# EAGLE design Tally Board (EAGLE 6.4)
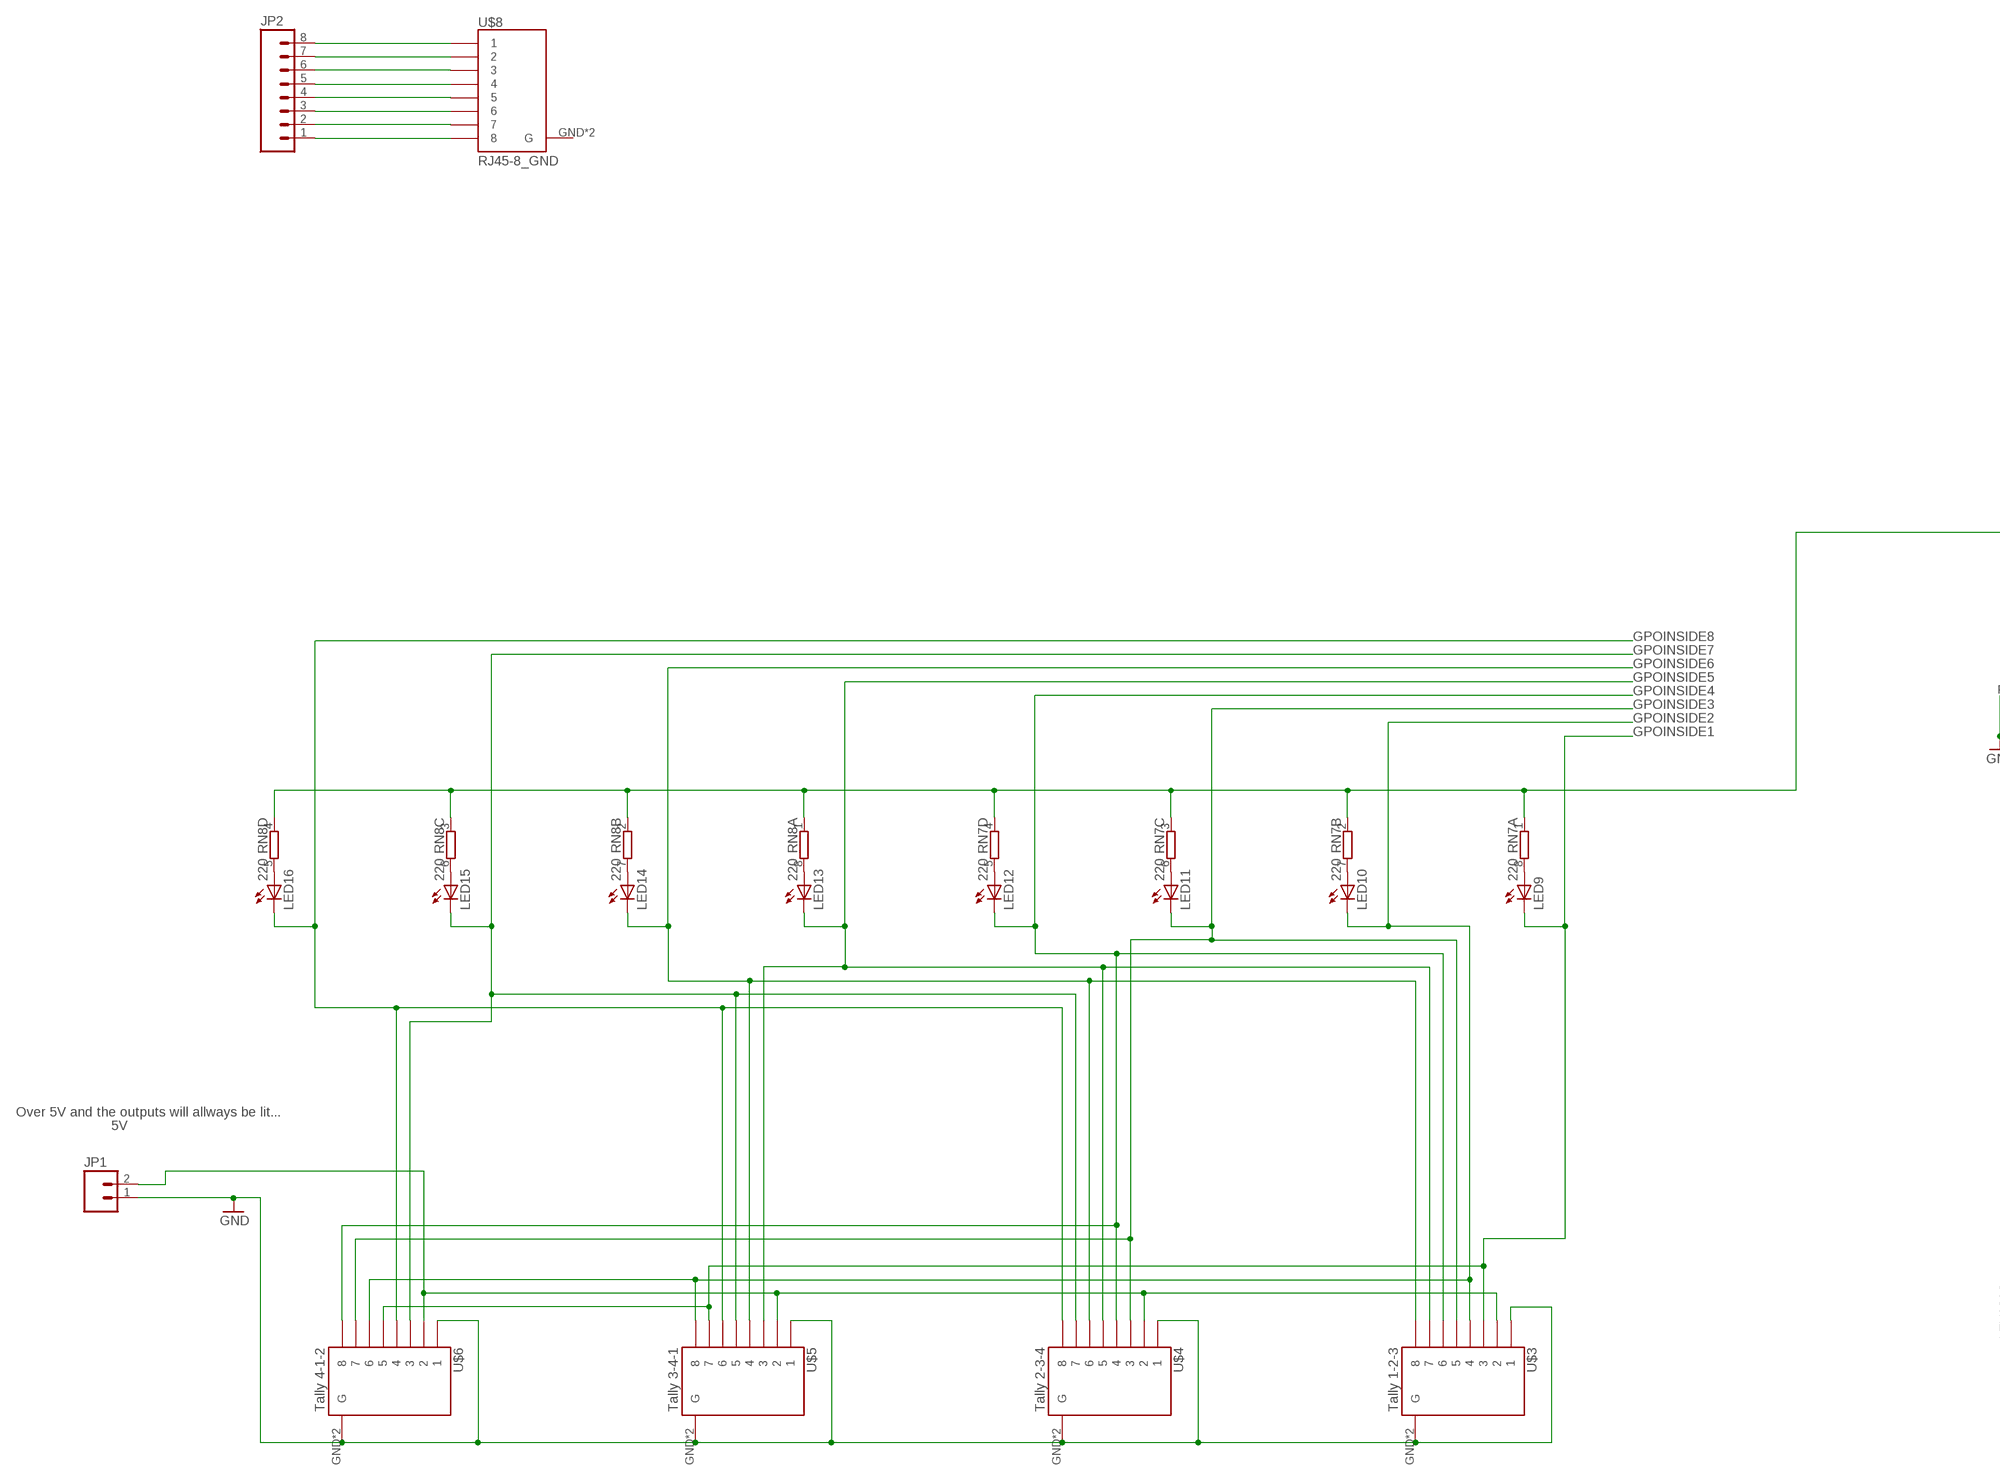
[diagram p0: schematic, sheet 1, part 1 of 2]
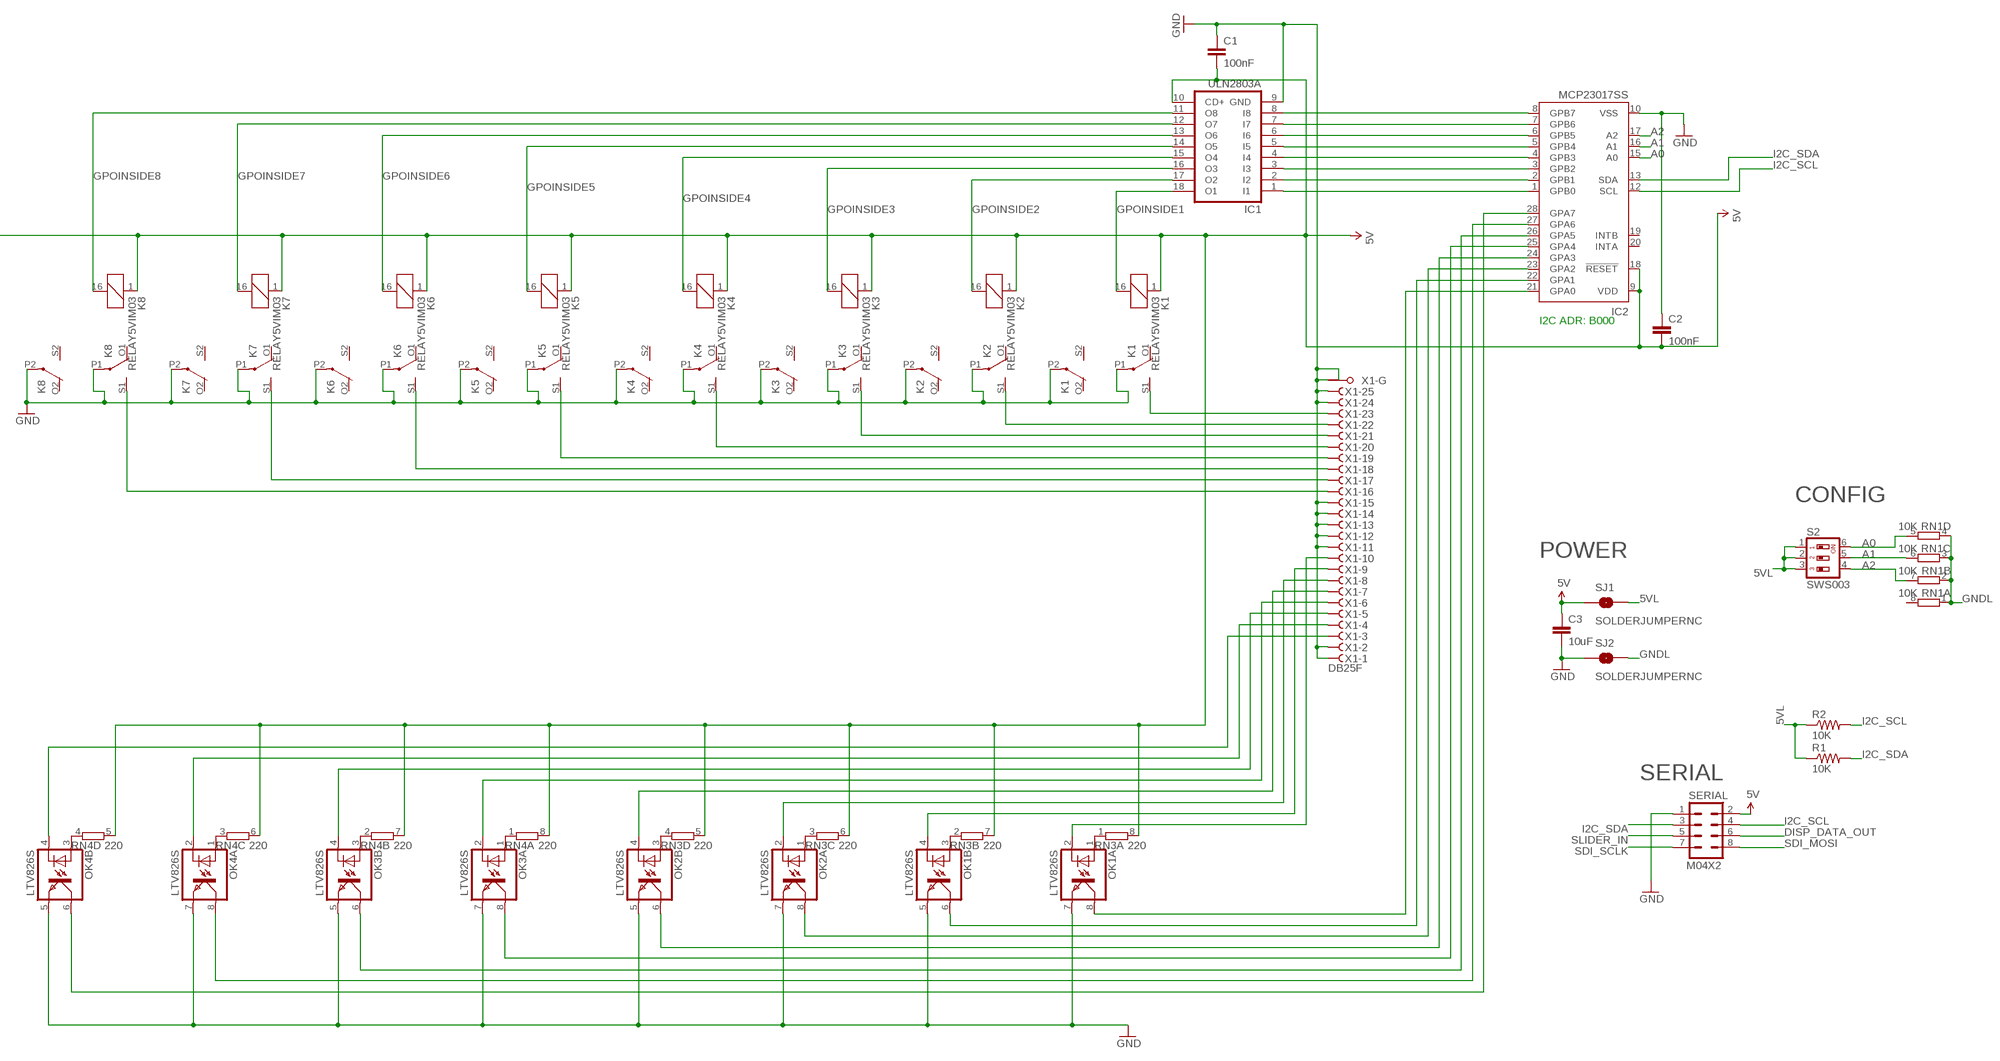
[diagram p1: schematic, sheet 1, part 2 of 2]

## Parts
C1  100nF  CAP0805  [0805]
C2  100nF  CAP0603-CAP  [0603-CAP]
C3  10uF  CAP0805  [0805]
IC1  ULN2803A  ULN2803ASO18W  [SO18W]
IC2  MCP23017SS  [SSOP28]
JP1  M02PTH4  [1X02_XTRA_BIG]
JP2  M081X08  [1X08]
K1  RELAY5VIM03  [DS2Y]
K2  RELAY5VIM03  [DS2Y]
K3  RELAY5VIM03  [DS2Y]
K4  RELAY5VIM03  [DS2Y]
K5  RELAY5VIM03  [DS2Y]
K6  RELAY5VIM03  [DS2Y]
K7  RELAY5VIM03  [DS2Y]
K8  RELAY5VIM03  [DS2Y]
LED9  LED3MM  [LED3MM]
LED10  LED3MM  [LED3MM]
LED11  LED3MM  [LED3MM]
LED12  LED3MM  [LED3MM]
LED13  LED3MM  [LED3MM]
LED14  LED3MM  [LED3MM]
LED15  LED3MM  [LED3MM]
LED16  LED3MM  [LED3MM]
OK1  LTV826S  [DIL8-SMD]
OK2  LTV826S  [DIL8-SMD]
OK3  LTV826S  [DIL8-SMD]
OK4  LTV826S  [DIL8-SMD]
R1  10K  RESISTOR0603-RES  [0603-RES]
R2  10K  RESISTOR0603-RES  [0603-RES]
RN1  10K  4R-NCAY16  [CAY16_HAND]
RN3  220  4R-NCAY16  [CAY16]
RN4  220  4R-NCAY16  [CAY16]
RN7  220  4R-NCAY16  [CAY16_HAND]
RN8  220  4R-NCAY16  [CAY16_HAND]
S2  SWS003  [SMS-003]
SERIAL  M04X2  [2X4]
SJ1  SOLDERJUMPERNC  [SJ_2S]
SJ2  SOLDERJUMPERNC  [SJ_2S]
U$3  Tally 1-2-3  RJ45-8_GND  [RJ45-8_GND]
U$4  Tally 2-3-4  RJ45-8_GND  [RJ45-8_GND]
U$5  Tally 3-4-1  RJ45-8_GND  [RJ45-8_GND]
U$6  Tally 4-1-2  RJ45-8_GND  [RJ45-8_GND]
U$8  RJ45-8_GND  [RJ45-8_GND]
X1  DB25F  F25HPS  [F25HP]

## Nets
5V [Power]: C1.2 C2.2 C3.1 IC1.10(CD+) IC2.9(VDD) IC2.18(!RESET) K1.1 K2.1 K3.1 K4.1 K5.1 K6.1 K7.1 K8.1 RN3.5 RN3.6 RN3.7 RN3.8 RN4.5 RN4.6 RN4.7 RN4.8 RN7.1 RN7.2 RN7.3 RN7.4 RN8.1 RN8.2 RN8.3 RN8.4 SERIAL.2 SJ1.1
5VL: R1.1 R2.1 S2.1 S2.2 S2.3 SJ1.2
A0: IC2.15(A0) RN1.5 S2.6
A1: IC2.16(A1) RN1.6 S2.5
A2: IC2.17(A2) RN1.7 S2.4
DISP_DATA_OUT: SERIAL.6
GND [Power]: C1.1 C2.1 C3.2 IC1.9(GND) IC2.10(VSS) JP1.1 K1.P1(2:P) K1.P2(3:P) K2.P1(2:P) K2.P2(3:P) K3.P1(2:P) K3.P2(3:P) K4.P1(2:P) K4.P2(3:P) K5.P1(2:P) K5.P2(3:P) K6.P1(2:P) K6.P2(3:P) K7.P1(2:P) K7.P2(3:P) K8.P1(2:P) K8.P2(3:P) OK1.5(B:EMIT) OK1.7(A:EMIT) OK2.5(B:EMIT) OK2.7(A:EMIT) OK3.5(B:EMIT) OK3.7(A:EMIT) OK4.5(B:EMIT) OK4.7(A:EMIT) SERIAL.1 SJ2.1 U$3.1 U$3.GND1(G) U$3.GND(G) U$4.1 U$4.GND1(G) U$4.GND(G) U$5.1 U$5.GND1(G) U$5.GND(G) U$6.1 U$6.GND1(G) U$6.GND(G) X1.1(-1:F) X1.2(-2:F) X1.11(-11:F) X1.12(-12:F) X1.13(-13:F) X1.14(-14:F) X1.15(-15:F) X1.24(-24:F) X1.25(-25:F) X1.G1(-G:G1) X1.G2(-G:G2)
GNDL: RN1.1 RN1.2 RN1.3 RN1.4 SJ2.2
GPOINSIDE1: IC1.18(O1) K1.16 LED9.K(C) U$3.3 U$5.7 U$6.5
GPOINSIDE2: IC1.17(O2) K2.16 LED10.K(C) U$3.4 U$5.8 U$6.6
GPOINSIDE3: IC1.16(O3) K3.16 LED11.K(C) U$3.5 U$4.3 U$6.7
GPOINSIDE4: IC1.15(O4) K4.16 LED12.K(C) U$3.6 U$4.4 U$6.8
GPOINSIDE5: IC1.14(O5) K5.16 LED13.K(C) U$3.7 U$4.5 U$5.3
GPOINSIDE6: IC1.13(O6) K6.16 LED14.K(C) U$3.8 U$4.6 U$5.4
GPOINSIDE7: IC1.12(O7) K7.16 LED15.K(C) U$4.7 U$5.5 U$6.3
GPOINSIDE8: IC1.11(O8) K8.16 LED16.K(C) U$4.8 U$5.6 U$6.4
I2C_SCL: IC2.12(SCL) R2.2 SERIAL.4
I2C_SDA: IC2.13(SDA) R1.2 SERIAL.3
N$1 [RELAY LINES]: K1.S1(2:S) X1.23(-23:F)
N$2: JP2.8 U$8.1
N$3: JP2.7 U$8.2
N$4: JP2.6 U$8.3
N$5: IC1.1(I1) IC2.1(GPB0)
N$6 [RELAY LINES]: K2.S1(2:S) X1.22(-22:F)
N$7: JP2.5 U$8.4
N$8: JP2.4 U$8.5
N$9: JP2.3 U$8.6
N$10 [RELAY LINES]: K3.S1(2:S) X1.21(-21:F)
N$11: JP2.2 U$8.7
N$12: JP2.1 U$8.8
N$14 [RELAY LINES]: K4.S1(2:S) X1.20(-20:F)
N$18 [RELAY LINES]: K5.S1(2:S) X1.19(-19:F)
N$22 [RELAY LINES]: K6.S1(2:S) X1.18(-18:F)
N$26 [RELAY LINES]: K7.S1(2:S) X1.17(-17:F)
N$27: LED9.A RN7.8
N$30 [RELAY LINES]: K8.S1(2:S) X1.16(-16:F)
N$31: LED10.A RN7.7
N$34: IC1.2(I2) IC2.2(GPB1)
N$35: IC1.3(I3) IC2.3(GPB2)
N$36: IC1.4(I4) IC2.4(GPB3)
N$37: IC1.5(I5) IC2.5(GPB4)
N$38: IC1.6(I6) IC2.6(GPB5)
N$39: IC1.7(I7) IC2.7(GPB6)
N$40: IC1.8(I8) IC2.8(GPB7)
N$49 [INput lines]: OK1.2(A:C) X1.10(-10:F)
N$50: OK1.1(A:A) RN3.1
N$51: IC2.21(GPA0) OK1.8(A:COL)
N$52: OK1.3(B:A) RN3.2
N$53: OK2.1(A:A) RN3.3
N$54: OK2.3(B:A) RN3.4
N$55 [INput lines]: OK3.2(A:C) X1.6(-6:F)
N$56: OK3.1(A:A) RN4.1
N$57: OK3.3(B:A) RN4.2
N$58: OK4.1(A:A) RN4.3
N$59: OK4.3(B:A) RN4.4
N$60 [INput lines]: OK1.4(B:C) X1.9(-9:F)
N$61 [INput lines]: OK2.2(A:C) X1.8(-8:F)
N$62 [INput lines]: OK2.4(B:C) X1.7(-7:F)
N$63: IC2.28(GPA7) OK4.6(B:COL)
N$64 [INput lines]: OK3.4(B:C) X1.5(-5:F)
N$65 [INput lines]: OK4.2(A:C) X1.4(-4:F)
N$66 [INput lines]: OK4.4(B:C) X1.3(-3:F)
N$68: IC2.22(GPA1) OK1.6(B:COL)
N$69: IC2.23(GPA2) OK2.8(A:COL)
N$70: IC2.24(GPA3) OK2.6(B:COL)
N$71: IC2.25(GPA4) OK3.8(A:COL)
N$72: IC2.26(GPA5) OK3.6(B:COL)
N$73: IC2.27(GPA6) OK4.8(A:COL)
N$76: LED11.A RN7.6
N$77: LED12.A RN7.5
N$78: LED13.A RN8.8
N$79: LED14.A RN8.7
N$80: LED15.A RN8.6
N$81: LED16.A RN8.5
N$82: JP1.2 U$3.2 U$4.2 U$5.2 U$6.2
SDI_MOSI: SERIAL.8
SDI_SCLK: SERIAL.7
SLIDER_IN: SERIAL.5
Unconnected: IC2.19(INTB) IC2.20(INTA) K1.O1(2:O) K1.O2(3:O) K1.S2(3:S) K2.O1(2:O) K2.O2(3:O) K2.S2(3:S) K3.O1(2:O) K3.O2(3:O) K3.S2(3:S) K4.O1(2:O) K4.O2(3:O) K4.S2(3:S) K5.O1(2:O) K5.O2(3:O) K5.S2(3:S) K6.O1(2:O) K6.O2(3:O) K6.S2(3:S) K7.O1(2:O) K7.O2(3:O) K7.S2(3:S) K8.O1(2:O) K8.O2(3:O) K8.S2(3:S) RN1.8

## Notes on the sheet
- I2C ADR: B000
- CONFIG
- POWER
- Over 5V and the outputs will allways be lit...
- 5V
- SERIAL

## Power pins joined to a net without a drawn wire
G: U$8.GND1(G) U$8.GND(G)

## Library data of the parts
C1-C3 = SparkFun:CAP: Capacitor Standard 0603 ceramic capacitor, and 0.1" leaded capacitor.
IC1 = uln-udn:ULN2803A: DRIVER ARRAY
IC2 = microchip:MCP23017: http://ww1.microchip.com/downloads/en/DeviceDoc/21952a.pdf Source: http://ww1.microchip.com/downloads/en/DeviceDoc/21952a.pdf; MF: MICROCHIP; MPN: MCP23017-E/SS; OC_FARNELL: 1467674; OC_NEWARK: 31K2960
JP1 = SparkFun:M02: Header 2 Standard 2-pin 0.1" header. Use with straight break away headers (SKU : PRT-00116), right angle break away headers (PRT-00553), swiss pins (PRT-00743), machine pins (PRT-00117), and female headers (PRT-00115). Molex polarized connector foot print use with SKU : PRT-08233 with associated crimp pins and housings.
JP2 = SKAARHOJ:M08: Header 8 Standard 8-pin 0.1" header. Use with straight break away headers (SKU : PRT-00116), right angle break away headers (PRT-00553), swiss pins (PRT-00743), machine pins (PRT-00117), and female headers (PRT-00115).
K1-K8 = SKAARHOJ:RELAY5V: RELAY 2 x switch, AxiCom 150 mW 5V
LED9-LED16 = led:LED: LED OSRAM: - CHIPLED LG R971, LG N971, LY N971, LG Q971, LY Q971, LO R971, LY R971 LH N974, LH R974 LS Q976, LO Q976, LY Q976 LO Q996 - Hyper CHIPLED LW Q18S LB Q993, LB Q99A, LB R99A - SideLED LS A670, LO A670, LY A670, LG A670, LP A670 LB A673, LV A673, LT A673, LW A673 LH A674 LY A675 LS A676, LA A676, LO A676, LY A676, LW A676 LS A679, LY A679, LG A679 - Hyper Micro SIDELED® LS Y876, LA Y876, LO Y876, LY Y876 LT Y87S - SmartLED LW L88C, LW L88S LB L89C, LB L89S, LG L890 LS L89K, LO L89K, LY L89K LS L896, LA L896, LO L896, LY L896 - TOPLED LS T670, LO T670, LY T670, LG T670, LP T670 LSG T670, LSP T670, LSY T670, LOP T670, LYG T670 LG T671, LOG T671, LSG T671 LB T673, LV T673, LT T673, LW T673 LH T674 LS T676, LA T676, LO T676, LY T676, LB T676, LH T676, LSB T676, LW T676 LB T67C, LV T67C, LT T67C, LS T67K, LO T67K, LY T67K, LW E67C LS E67B, LA E67B, LO E67B, LY E67B, LB E67C, LV E67C, LT E67C LW T67C LS T679, LY T679, LG T679 LS T770, LO T770, LY T770, LG T770, LP T770 LB T773, LV T773, LT T773, LW T773 LH T774 LS E675, LA E675, LY E675, LS T675 LS T776, LA T776, LO T776, LY T776, LB T776 LHGB T686 LT T68C, LB T68C - Hyper Mini TOPLED® LB M676 - Mini TOPLED Santana® LG M470 LS M47K, LO M47K, LY M47K Source: http://www.osram.convergy.de LUXEON: - LUMILED® LXK2-PW12-R00, LXK2-PW12-S00, LXK2-PW14-U00, LXK2-PW14-V00 LXK2-PM12-R00, LXK2-PM12-S00, LXK2-PM14-U00 LXK2-PE12-Q00, LXK2-PE12-R00, LXK2-PE12-S00, LXK2-PE14-T00, LXK2-PE14-U00 LXK2-PB12-K00, LXK2-PB12-L00, LXK2-PB12-M00, LXK2-PB14-N00, LXK2-PB14-P00, LXK2-PB14-Q00 LXK2-PR12-L00, LXK2-PR12-M00, LXK2-PR14-Q00, LXK2-PR14-R00 LXK2-PD12-Q00, LXK2-PD12-R00, LXK2-PD12-S00 LXK2-PH12-R00, LXK2-PH12-S00 LXK2-PL12-P00, LXK2-PL12-Q00, LXK2-PL12-R00 Source: www.luxeon.com KINGBRIGHT: KA-3528ASYC Source: www.kingbright.com
OK1-OK4 = optocoupler:LTV826: OPTO COUPLER Source: LITEON, LTV816.pdf; OC_FARNELL: unknown; OC_NEWARK: unknown
R1 R2 = SparkFun:RESISTOR: Resistor Basic schematic elements and footprints for 0603, 1206, and PTH resistors.
RN1 RN7 RN8 = SKAARHOJ:4R-N: Array Chip Resistor Source: RS Component / Phycomp; OC_FARNELL: unknown; OC_NEWARK: unknown
RN3 RN4 = resistor-dil:4R-N: Array Chip Resistor Source: RS Component / Phycomp; OC_FARNELL: unknown; OC_NEWARK: unknown
S2 = smd-special:SWS003: SMD Dip Switch 3 pol.
SERIAL = SparkFun:M04X2
SJ1 SJ2 = SparkFun:SOLDERJUMPER: Solder Jumper Standard SMD solder jumper. Used to automate production. Two varients : Normally Open and Normally Closed are the same, but have different paste layers. NC will have a large amount of paste and should jumper during reflow.
U$3-U$6 U$8 = SKAARHOJ:RJ45-8_GND
X1 = con-subd:F25HPS: SUB-D; OC_FARNELL: unknown; OC_NEWARK: unknown

## Net classes
0 default: width 0.203 mm, drill 0.406 mm, clearance 0.203 mm
1 Power: width 0.406 mm, drill 0.61 mm, clearance 0.203 mm
2 RELAY LINES: width 0.305 mm, clearance 0.254 mm
3 INput lines: clearance 0.254 mm

## Board
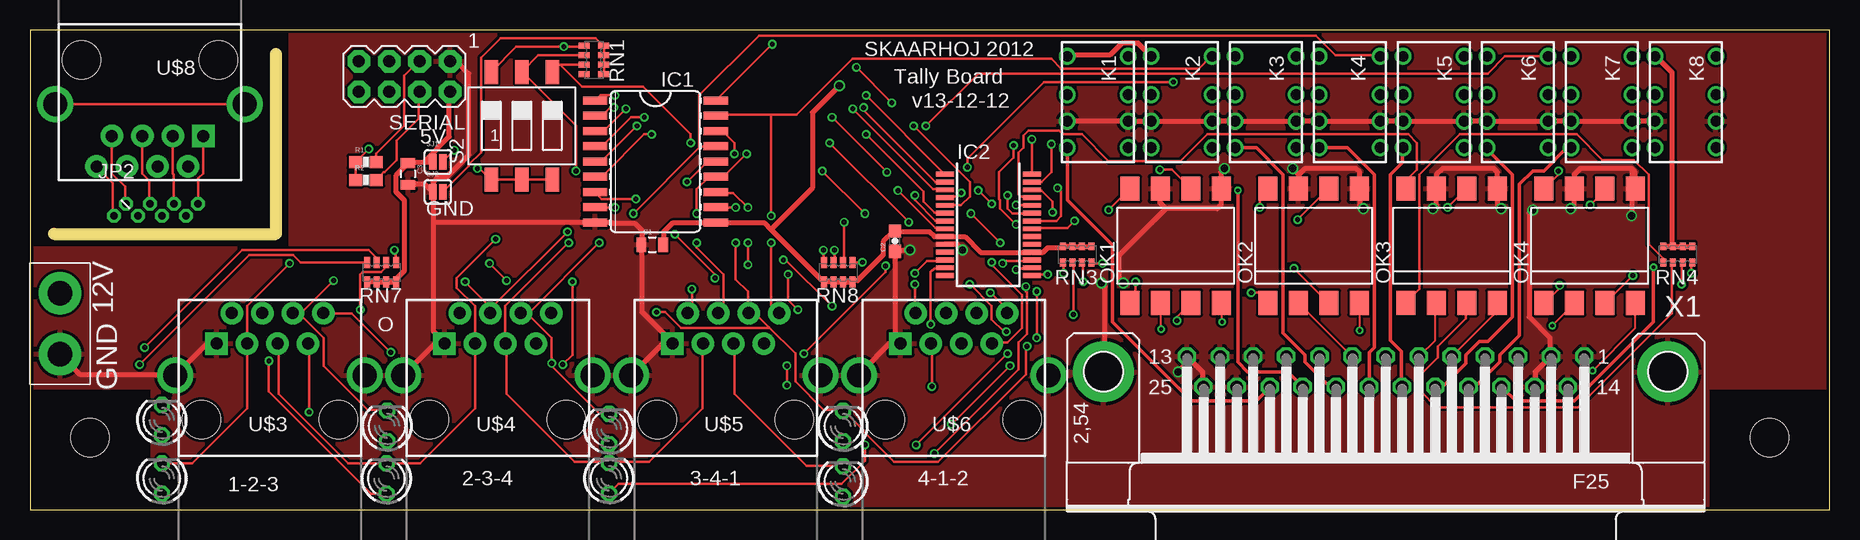
[diagram p2: board, top side]
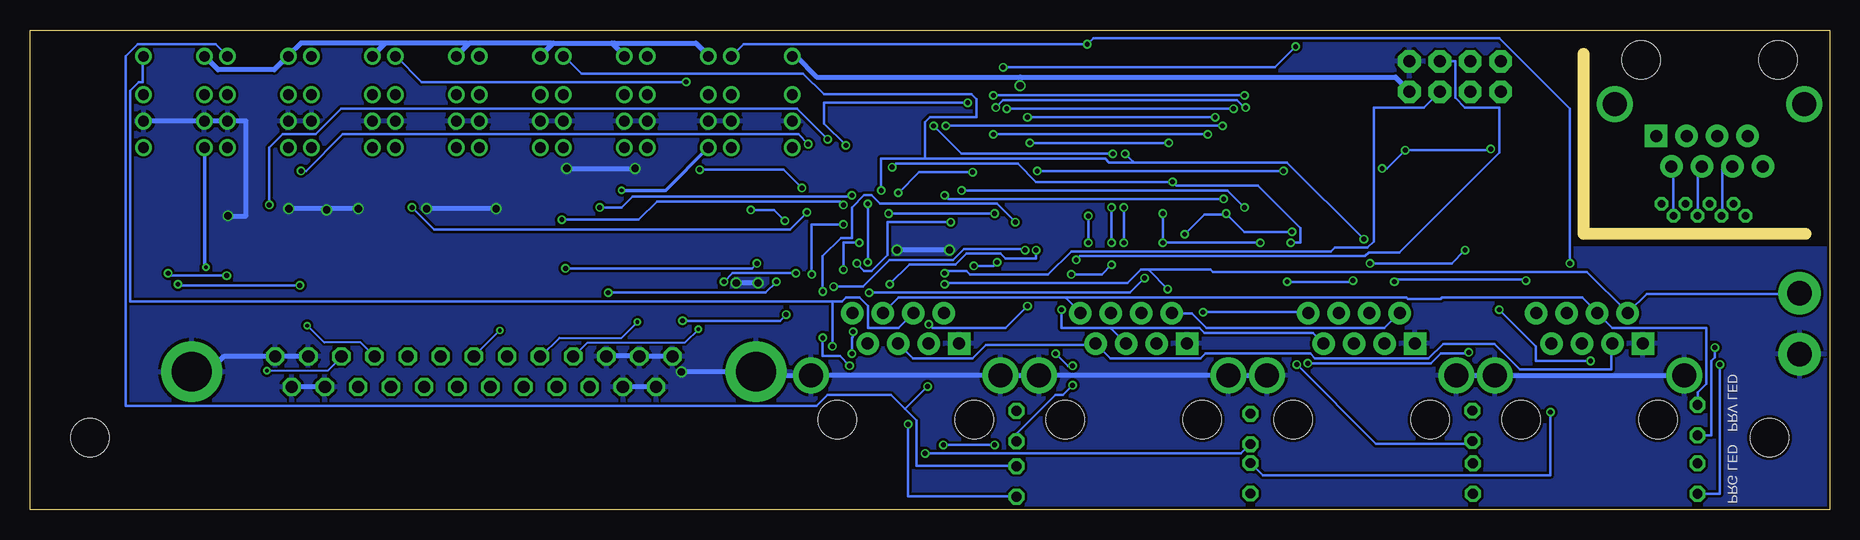
[diagram p3: board, bottom side, seen from below]

Size 150 x 40 mm. Coordinates in mm from the lower left corner, seen from the top.
Outline: 150,0 150,40 0,40 0,0 150,0
Copper layers (1*16): Top 0.035mm / dielectric 1.5mm / Bottom 0.035mm
Design rules: minimum track width 6mil, minimum drill 12mil, track to track 6mil, track to pad 6mil, pad to pad 6mil, via to via 6mil, smd to smd 0mil, copper to edge 10mil, drill to drill 10mil, minimum pad ring 10mil, minimum via ring 6mil, stop-mask expansion 2mil, vias tented up to drill 100mil, thermal gap 10mil
Holes 3.2 mm at 5,6 145,6
bKeepout: area 0,0 to 10,10; area 140,0 to 150,10
tRestrict: area 0,0 to 10,10; area 140,0 to 150,10; area 0,22 to 20.5,23; area 20.5,22 to 21.5,40
bRestrict: area 20.5,22 to 21.5,40; area 0,22 to 20.5,23
Milling: 2 lines

### Footprints (pad centres in the part's own frame; a part is rotated, then mirrored left to right if it is on the bottom)
0805 = smd 0.8 x 1.2: 1 -0.9,0; 2 0.9,0
0603-CAP = smd 1.1 x 1: 1 -0.85,0; 2 0.85,0
SO18W = smd 0.66 x 2.032: 1 -5.08,-5.029; 2 -3.81,-5.029; 3 -2.54,-5.029; 4 -1.27,-5.029; 5 0,-5.029; 6 1.27,-5.029; 7 2.54,-5.029; 8 3.81,-5.029; 9 5.08,-5.029; 10 5.08,5.029; 11 3.81,5.029; 12 2.54,5.029; 13 1.27,5.029; 14 0,5.029; 15 -1.27,5.029; 16 -2.54,5.029; 17 -3.81,5.029; 18 -5.08,5.029
SSOP28 = smd 0.4 x 1.5: 1 -4.225,-3.625; 2 -3.575,-3.625; 3 -2.925,-3.625; 4 -2.275,-3.625; 5 -1.625,-3.625; 6 -0.975,-3.625; 7 -0.325,-3.625; 8 0.325,-3.625; 9 0.975,-3.625; 10 1.625,-3.625; 11 2.275,-3.625; 12 2.925,-3.625; 13 3.575,-3.625; 14 4.225,-3.625; 15 4.225,3.625; 16 3.575,3.625; 17 2.925,3.625; 18 2.275,3.625; 19 1.625,3.625; 20 0.975,3.625; 21 0.325,3.625; 22 -0.325,3.625; 23 -0.975,3.625; 24 -1.625,3.625; 25 -2.275,3.625; 26 -2.925,3.625; 27 -3.575,3.625; 28 -4.225,3.625
1X02_XTRA_BIG = drill 2.057 pad 3.556: 1 -2.54,0; 2 2.54,0
1X08 = drill 0.6 octagon: 1 0,0; 2 1,1; 3 2,0; 4 3,1; 5 4,0; 6 5,1; 7 6,0; 8 7,1
DS2Y = drill 0.9: 1 1.2,0.46; 16 1.2,5.54; O1 4.4,0.46; O2 4.4,5.54; P1 6.6,0.46; P2 6.6,5.54; S1 8.8,0.46; S2 8.8,5.54
LED3MM = drill 0.813 octagon: A -1.27,0; K 1.27,0
DIL8-SMD = smd 1.6 x 2: 1 -3.81,-4.77; 2 -1.27,-4.77; 3 1.27,-4.77; 4 3.81,-4.77; 5 3.81,4.77; 6 1.27,4.77; 7 -1.27,4.77; 8 -3.81,4.77
0603-RES = smd 1.1 x 1: 1 -0.85,0; 2 0.85,0
CAY16_HAND = smd 0.5 x 0.904: 1 -1.2,-0.813; 2 -0.4,-0.813; 3 0.4,-0.813; 4 1.2,-0.813; 5 1.2,0.813; 6 0.4,0.813; 7 -0.4,0.813; 8 -1.2,0.813
CAY16 = smd 0.5 x 0.65: 1 -1.2,-0.675; 2 -0.4,-0.675; 3 0.4,-0.675; 4 1.2,-0.675; 5 1.2,0.675; 6 0.4,0.675; 7 -0.4,0.675; 8 -1.2,0.675
SMS-003 = smd 1.092 x 2.007: 1 -2.54,-4.496; 2 0,-4.496; 3 2.54,-4.496; 4 2.54,4.496; 5 0,4.496; 6 -2.54,4.496
2X4 = drill 1.016 pad 1.88 octagon: 1 -3.81,-1.27; 2 -3.81,1.27; 3 -1.27,-1.27; 4 -1.27,1.27; 5 1.27,-1.27; 6 1.27,1.27; 7 3.81,-1.27; 8 3.81,1.27
SJ_2S = smd 0.635 x 1.27: 1 -0.412,0; 2 0.412,0
RJ45-8_GND = drill 1 pad 1.88 square: 1 -4.445,6.35 | drill 1 pad 1.88: 2 -3.175,8.89; 3 -1.905,6.35; 4 -0.635,8.89; 5 0.635,6.35; 6 1.905,8.89; 7 3.175,6.35; 8 4.445,8.89 | drill 2: GND -7.9,3.7; GND1 7.9,3.7 | hole 3.2: -5.715,0; 5.715,0
F25HP = drill 1.016 octagon: 1 -16.561,-1.27; 2 -13.792,-1.27; 3 -11.049,-1.27; 4 -8.28,-1.27; 5 -5.512,-1.27; 6 -2.769,-1.27; 7 0,-1.27; 8 2.769,-1.27; 9 5.512,-1.27; 10 8.28,-1.27; 11 11.049,-1.27; 12 13.792,-1.27; 13 16.561,-1.27; 14 -15.189,1.27; 15 -12.421,1.27; 16 -9.652,1.27; 17 -6.909,1.27; 18 -4.14,1.27; 19 -1.372,1.27; 20 1.372,1.27; 21 4.14,1.27; 22 6.909,1.27; 23 9.652,1.27; 24 12.421,1.27; 25 15.189,1.27 | drill 3.302 pad 5.08: G1 -23.52,0; G2 23.52,0

### Placement (x,y rotation side)
C1  51.87,22.09 0 top
C2  72.1,22.39 90 top
C3  31.5,28 270 top
IC1  52.13,29.03 270 top
IC2  79.89,23.75 270 top
JP1  2.5,15.5 90 top
JP2  7,24.5 0 top
K1  86,39 270 top
K2  93,39 270 top
K3  100,39 270 top
K4  107,39 270 top
K5  114,39 270 top
K6  121,39 270 top
K7  128,39 270 top
K8  135,39 270 top
LED9  11,2.58 90 top
LED10  11,7.46 90 top
LED11  29.72,2.58 90 top
LED12  29.77,6.98 90 top
LED13  48.27,2.6 90 top
LED14  48.27,6.72 90 top
LED15  67.77,2.34 90 top
LED16  67.77,6.96 90 top
OK1  95.5,22 0 top
OK2  107,22 0 top
OK3  118.5,22 0 top
OK4  130,22 0 top
R1  28,29 0 top
R2  28,27.5 0 top
RN1  47,37.5 90 top
RN3  87.29,21.29 0 top
RN4  137.35,21.29 0 top
RN7  29.3,19.78 0 top
RN8  67.38,19.78 0 top
S2  41,32 0 top
SERIAL  31.21,36.12 180 top
SJ1  34,29 0 top
SJ2  34,26.5 0 top
U$3  20,7.5 0 top
U$4  39,7.5 0 top
U$5  58,7.5 0 top
U$6  77,7.5 0 top
U$8  10,37.5 180 top
X1  113,11.5 180 top

### Tracks (layer width: path | path; a pad name or v marks a point on that pad's centre or on a via)
5V  (via drill 0.61)
  Top 0.406: C1.2 52.83,22.15 52.83,23.16 53.54,23.88 57.1,23.88 IC1.10 57.3,23.88 61.27,23.88 61.77,23.37 | RN3.5 88.39,21.95 87.88,21.95 RN3.6 87.68,21.95 87.07,21.95 RN3.7 86.87,21.95 86.16,21.95 RN3.8 85.95,21.84 84.84,21.84 84.43,21.44 83.52,21.44 IC2.18 83.41,21.44 79.25,21.44 77.93,22.76 76.4,22.76 IC2.9 76.2,22.76 75.39,22.76 74.98,23.16 72.14,23.16 C2.2 71.93,23.16 71.12,22.35 71.12,21.23 68.99,19.1 68.68,19.1 RN8.4 68.58,19 67.97,19 RN8.3 67.77,19 67.16,19 RN8.2 66.95,19 66.24,19 RN8.1 66.04,19.1 61.77,23.37 | RN7.1 28.14,19 28.85,19 RN7.2 29.06,19 29.67,19 RN7.3 29.87,19 30.48,19 RN7.4 30.48,19.2 31.19,19.91 31.19,25.81 30.48,26.52 30.48,27.84 31.39,28.75 C3.1 31.6,28.96 32.92,28.96 | 32.92,28.96 33.53,28.96 SJ1.1 | SERIAL.2 34.95,34.85 34.95,31.09 32.92,29.06 32.92,28.96 | RN4.8 136.25,21.95 136.85,21.95 RN4.7 | RN4.7 137.16,21.95 137.67,21.95 RN4.6 137.87,21.95 138.48,21.95 RN4.5 | RN4.7 136.85,22.15 136.85,36.47 135.53,37.8 K8.1 | K1.1 86.46,37.9 90.02,37.9 91.03,38.91 92.35,38.91 93.37,37.9 K2.1 | 61.77,23.37 65.23,26.82 65.23,33.12 v67.46,35.36
  Bottom 0.406: 101.4,38.81 101.5,38.91 106.38,38.91 106.48,38.81 | 101.4,38.81 100.48,37.9 K3.1 | 106.48,38.81 107.39,37.9 K4.1 | 113.49,38.81 113.39,38.91 106.58,38.91 106.48,38.81 | 113.49,38.81 114.4,37.9 K5.1 | 120.5,38.81 120.4,38.91 113.59,38.91 113.49,38.81 | 120.5,38.81 121.41,37.9 K6.1 | 120.5,38.81 120.6,38.91 127.41,38.91 128.42,37.9 K7.1 128.63,37.69 129.64,36.68 134.31,36.68 135.43,37.8 K8.1 | K2.1 93.47,37.9 94.49,38.91 101.3,38.91 101.4,38.81 | 67.46,36.07 84.43,36.07 86.16,37.8 86.36,37.8 K1.1 | 67.46,36.07 36.17,36.07 35.05,34.95 SERIAL.2 | 67.46,36.07 v67.46,35.36
5VL  (via drill 0.41)
  Top 0.203: S2.3 43.48,27.53 41.05,27.53 S2.2 40.95,27.53 38.51,27.53 S2.1 38.41,27.53 37.49,28.45 v37.29,28.45 | R2.1 27.13,27.53 27.13,28.96 R1.1 27.23,29.06 v28.25,30.07 | v35.36,29.97 34.44,29.06 SJ1.2
  Bottom 0.203: v37.29,28.45 36.88,28.45 v35.36,29.97 28.35,29.97 v28.25,30.07
A0  (via drill 0.41)
  Top 0.203: RN1.5 46.13,38.61 v44.5,38.61 40.54,38.61 38.51,36.58 S2.6 | v84.84,19.61 83.52,19.61 IC2.15 | v82.19,23.77 80.87,25.09 80.87,25.81 80.77,25.91 80.77,28.14 81.99,29.36 v81.99,30.38 | v68.89,36.88 v71.83,33.93
  Bottom 0.203: v84.84,19.61 84.84,23.77 v82.19,23.77 | v81.99,30.38 83.82,32.21 83.82,33.93 v71.83,33.93 | v68.89,36.88 46.23,36.88 v44.5,38.61
A1  (via drill 0.41)
  Top 0.203: RN1.6 46.13,37.9 42.37,37.9 41.05,36.58 S2.5 41.05,36.47 45.52,32 v45.52,28.25 | v82.19,20.02 82.3,20.12 83.41,20.12 IC2.16 | v78.44,24.69 v80.87,22.25 | v66.04,28.25 v69.6,24.69
  Bottom 0.203: v82.19,20.02 82.19,22.25 v80.87,22.25 | v69.6,24.69 v78.44,24.69 | v45.52,28.25 v66.04,28.25
A2  (via drill 0.41)
  Top 0.203: 44.2,37.08 44.09,37.08 43.59,36.58 S2.4 | 44.2,37.08 46.13,37.08 RN1.7 | v81.08,20.52 81.28,20.73 83.41,20.73 IC2.17 | v66.65,30.58 v73.25,23.98 | v55.07,30.58 55.07,31.29 51.1,35.26 46.02,35.26 44.2,37.08
  Bottom 0.203: v81.08,20.52 80.47,19.91 79.86,19.91 78.54,21.23 78.54,23.98 v73.25,23.98 | v55.07,30.58 v66.65,30.58
G
  Top 0.203: U$8.GND1 2.13,33.83 17.88,33.83 U$8.GND
GND  (via drill 0.61)
  Top 0.406: X1.15 125.48,10.26 125.48,11.48 126.69,12.7 X1.2 126.69,12.9 126.69,14.33 124.97,16.05 124.97,24.69 v125.27,24.99 | 133.5,28.45 129.24,28.45 128.73,27.94 128.73,26.82 OK4.7 128.73,26.62 128.73,25.4 v128.42,25.09 | OK4.5 133.81,26.82 133.81,28.14 133.5,28.45 | 94.69,25.09 94.18,25.6 94.18,26.72 OK1.7 | 94.69,25.09 98.96,25.09 99.26,25.4 99.26,26.72 OK1.5 99.26,26.92 99.26,28.14 v99.57,28.45 | 105.77,27.94 105.77,26.82 OK2.7 | 105.77,27.94 106.27,28.45 110.54,28.45 110.85,28.14 110.85,26.82 OK2.5 110.85,26.62 110.85,25.4 v111.15,25.09 | 105.77,27.94 v105.26,28.45 | v116.94,25.09 117.25,25.4 117.25,26.62 OK3.7 117.25,26.82 117.25,27.94 117.75,28.45 122.02,28.45 122.33,28.14 122.33,26.82 OK3.5 122.33,26.62 122.33,25.4 v122.63,25.09 | X1.25 97.74,10.26 97.74,11.48 96.52,12.7 X1.13 96.62,12.39 v95.71,11.48 | v77.72,21.64 77.22,22.15 76.3,22.15 IC2.10 | v73.36,21.64 72.24,21.64 C2.1 72.14,21.54 72.14,14.33 72.54,13.92 U$6.1 72.03,14.22 69.09,11.28 U$6.GND | U$3.1 15.54,13.82 14.73,13.82 12.19,11.28 U$3.GND 11.99,11.28 4.17,11.28 2.54,12.9 JP1.1 | U$5.GND 50.19,11.28 53.14,14.22 U$5.1 53.54,13.92 51,16.46 51,21.95 C1.1 51,22.15 51,23.27 50.39,23.88 48.56,23.88 48.46,23.98 47.14,23.98 IC1.9 46.94,23.98 33.63,23.98 | C3.2 31.6,27.13 32.92,27.13 33.53,26.52 SJ2.1 | 33.63,23.98 33.63,14.83 34.54,13.92 U$4.1 34.14,14.22 31.19,11.28 U$4.GND | 33.63,23.98 33.63,26.31 SJ2.1 | SERIAL.1 35.05,37.39 35.56,37.39 36.58,36.37 36.58,29.57 34.75,27.74 34.04,27.74 33.63,27.33 33.63,26.62 SJ2.1 | 94.69,25.09 90.83,21.23 90.83,19.2 v91.14,18.9 | v89.31,18.9 89.61,18.59 89.61,11.68 89.51,11.58 X1.G2
  Top 0.406: K8.P1 135.43,32.41 133.6,32.41 K7.P2 133.4,32.41 128.63,32.41 K7.P1 128.42,32.41 126.59,32.41 K6.P2 126.39,32.41 121.61,32.41 K6.P1 121.41,32.41 119.58,32.41 K5.P2 119.38,32.41 114.61,32.41 K5.P1 114.4,32.41 112.57,32.41 K4.P2 112.37,32.41 107.59,32.41 K4.P1 107.39,32.41 105.56,32.41 K3.P2 105.36,32.41 100.58,32.41 K3.P1 100.38,32.41 98.55,32.41 K2.P2 98.35,32.41 93.57,32.41 K2.P1 93.37,32.41 91.75,32.41 K1.P2 91.44,32.41 K1.P1 | 133.5,28.45 v133.5,24.5
  Bottom 0.406: X1.15 125.48,10.26 128.12,10.26 X1.14 | X1.2 126.8,12.8 129.54,12.8 X1.1 129.74,12.8 133.81,12.8 135.13,11.48 136.45,11.48 X1.G1 | v105.26,28.45 v99.57,28.45 | v111.15,25.09 v116.94,25.09 | v122.63,25.09 125.27,25.09 | 125.27,25.09 v128.42,25.09 | v125.27,24.99 125.27,25.09 | X1.25 97.84,10.26 100.48,10.26 X1.24 | X1.13 96.52,12.8 99.16,12.8 X1.12 99.36,12.8 101.91,12.8 X1.11 | v95.71,11.48 89.51,11.48 X1.G2 89.31,11.48 88.09,11.48 87.78,11.18 84.94,11.18 U$6.GND1 84.73,11.18 69.29,11.18 U$6.GND 69.09,11.18 65.94,11.18 U$5.GND1 65.73,11.18 50.29,11.18 U$5.GND 50.09,11.18 46.94,11.18 U$4.GND1 | v73.36,21.64 v77.72,21.64 | U$4.GND 31.09,11.18 27.94,11.18 U$3.GND1 27.74,11.18 12.19,11.18 U$3.GND | v89.31,18.9 v91.14,18.9 | K8.P2 140.51,32.41 135.53,32.41 K8.P1 132,32.41 132,24.5 v133.5,24.5
  pour Bottom: 0,0 0,40 150,40 150,0
  pour Top: 0,0 0,40 150,40 150,0
GNDL
  Top 0.203: RN1.1 47.85,36.37 47.85,37.08 RN1.2 47.85,37.19 47.85,37.9 RN1.3 47.85,38 47.85,38.61 RN1.4 47.75,38.71 47.14,39.32 39.22,39.32 37.59,37.69 37.59,29.77 36.58,28.75 36.58,28.65 34.44,26.52 SJ2.2
GPOINSIDE1  (via drill 0.41)
  Top 0.203: v61.87,38.81 57.2,34.14 IC1.18 | LED9.K 11.07,3.86 13.51,3.86 18.09,8.43 18.09,13.82 U$3.3 18.09,13.92 18.09,16.97 v21.64,20.52
  Bottom 0.203: K1.16 91.44,37.9 90.53,38.81 v61.87,38.81 61.37,39.32 27.53,39.32 21.64,33.43 v21.64,20.52 | U$6.5 77.62,13.82 76.4,12.6 71.42,12.6 70.31,13.72 61.37,13.72 61.27,13.82 U$5.7 61.16,13.82 59.94,12.6 52.43,12.6 52.02,13.01 43.28,13.01 42.88,12.6 33.43,12.6 32.21,13.82 27.94,13.82 25.81,11.68 18.19,11.68 18.19,13.82 U$3.3
GPOINSIDE2  (via drill 0.41)
  Top 0.203: 61.77,32.92 63.91,32.92 68.58,37.59 85.14,37.59 85.95,36.78 97.43,36.78 98.45,37.8 K2.16 | 61.77,32.92 57.2,32.92 IC1.17 | v61.77,24.49 61.77,32.92 | v61.77,22.25 61.77,17.07 62.38,16.46 U$5.8
  Bottom 0.203: LED10.K 10.97,8.74 10.97,9.75 10.26,10.46 10.26,15.14 18.09,15.14 19.3,16.36 U$3.4 19.41,16.46 20.62,17.68 32.31,17.68 32.41,17.58 35.15,17.58 35.26,17.68 63.6,17.68 63.65,17.63 | 63.65,17.63 63.7,17.68 77.62,17.68 78.84,16.46 U$6.6 | 63.65,17.63 62.48,16.46 U$5.8 | v61.77,22.25 v61.77,24.49
GPOINSIDE3  (via drill 0.41)
  Top 0.203: v58.73,29.67 58.73,30.58 57.81,31.5 57.2,31.5 IC1.16 | v38.81,22.55 35.56,19.3 35.56,18.49 37.08,16.97 37.08,13.92 U$4.3 37.08,13.82 37.08,8.43 32.51,3.86 29.77,3.86 LED11.K 29.67,3.86 26.52,3.86 20.73,9.65 20.73,13.82 U$3.5 | v80.16,20.62 80.16,20.42 82.7,17.88 82.7,15.14 81.48,13.92 80.26,13.92 U$6.7 | v79.05,26.62 v80.16,25.5
  Bottom 0.203: 58.06,29.01 58.01,28.96 45.21,28.96 v38.81,22.55 | 58.06,29.01 v58.73,29.67 | 75.39,29.26 75.39,32.31 74.98,32.72 71.12,32.72 71.12,34.24 71.53,34.65 83.82,34.65 85.55,36.37 104.04,36.37 105.46,37.8 K3.16 | 75.39,29.26 60.35,29.26 60.05,28.96 58.12,28.96 58.06,29.01 | v80.16,25.5 v80.16,20.62 | v79.05,26.62 79.05,29.26 75.39,29.26
GPOINSIDE4  (via drill 0.41)
  Top 0.203: LED12.K 29.77,8.33 28.14,8.33 24.49,11.99 24.49,14.33 22.45,16.36 21.95,16.36 U$3.6 22.55,16.36 v25.3,19.1 | v50.29,24.69 55.83,30.23 | 55.83,30.23 55.88,30.28 57.1,30.28 IC1.15 | v44.81,23.16 38.41,16.76 38.41,16.46 U$4.4 38.41,16.87 v36.27,19 | K4.16 112.47,37.9 108.81,37.9 107.19,39.52 60.76,39.52 55.78,34.54 55.78,30.28 55.83,30.23 | v80.06,18.09 81.38,16.76 81.38,16.46 U$6.8 | v57.1,19.3 57.1,19.61 v53.75,22.96
  Bottom 0.203: v44.81,23.16 48.77,23.16 v50.29,24.69 50.29,24.59 52.12,24.59 v53.75,22.96 | v80.06,18.09 58.32,18.09 v57.1,19.3 | v25.3,19.1 25.4,19.2 36.07,19.2 v36.27,19
GPOINSIDE5  (via drill 0.41)
  Top 0.203: U$5.3 56.08,13.82 56.08,8.43 51.61,3.96 48.36,3.96 LED13.K 48.26,3.96 45.41,3.96 39.73,9.65 39.73,13.82 U$4.5 39.62,13.92 39.62,16.97 v44.91,22.25 | v23.27,8.13 23.27,13.82 U$3.7 | v54.76,27.33 56.39,28.96 57.1,28.96 IC1.14 | v95.3,35.66 84.53,35.66 78.13,29.26 v78.13,28.55
  Bottom 0.203: v23.27,8.13 23.27,2.85 47.24,2.85 LED13.K | v44.91,22.25 44.09,22.25 44.09,23.47 47.65,27.03 54.46,27.03 v54.76,27.33 66.14,27.33 67.67,28.85 77.83,28.85 v78.13,28.55 | v95.3,35.66 117.35,35.66 119.48,37.8 K5.16
GPOINSIDE6  (via drill 0.41)
  Top 0.203: LED14.K 48.26,8.03 47.45,8.03 43.48,11.99 v43.48,12.19 43.48,14.33 41.45,16.36 40.95,16.36 U$4.6 41.55,16.36 v47.45,22.25 | v30.07,13.11 26.82,16.36 24.49,16.36 U$3.8 | v55.58,24.69 55.58,26.72 56.59,27.74 57.1,27.74 IC1.13 57.2,27.84 57.91,27.84 v59.74,29.67 | v55.58,22.25 55.58,21.84 57.81,19.61 57.81,16.87 57.4,16.46 U$5.4 | v74.68,32 79.05,36.37 121.51,36.37 122.94,37.8 126.49,37.8 K6.16
  Bottom 0.203: v30.07,13.11 30.18,13.01 32.41,13.01 33.22,12.19 v43.48,12.19 | v55.58,24.69 v55.58,22.25 v47.45,22.25 | v74.68,32 72.34,29.67 v59.74,29.67
GPOINSIDE7  (via drill 0.41)
  Top 0.203: v59.84,25.2 58.62,26.42 57.2,26.42 IC1.12 | v59.84,20.42 v59.84,22.25 | v63.2,19.61 63.2,17.48 v64.01,16.66 | LED15.K 67.77,3.66 64.72,3.66 58.73,9.65 58.73,13.82 U$5.5 | v75.18,10.26 75.18,13.82 U$6.3
  Bottom 0.203: v59.84,22.25 v59.84,25.2 | v59.84,20.42 60.66,19.61 v63.2,19.61 | v64.01,16.66 64.01,15.14 59.94,15.14 59.89,15.09 | 59.89,15.09 58.73,13.92 U$5.5 | 77.06,8.38 76.1,7.42 76.1,3.66 67.87,3.66 LED15.K | 77.06,8.38 78.23,9.55 83.52,9.55 84.43,8.64 142.04,8.64 142.04,37.8 141.02,38.81 134.52,38.81 133.6,37.9 K7.16 | U$4.7 42.27,13.92 43.08,14.73 52.12,14.73 52.53,15.14 59.84,15.14 59.89,15.09 | 77.06,8.38 v75.18,10.26
GPOINSIDE8  (via drill 0.41)
  Top 0.203: v58.83,25.2 57.2,25.2 IC1.11 | v58.83,22.25 58.83,19.2 59.84,18.19 59.84,16.97 | 59.84,16.97 59.84,16.46 U$5.6 59.84,16.97 | 59.84,16.97 61.62,15.19 | 61.62,15.19 63.8,13.01 63.8,10.67 66.14,8.33 67.77,8.33 LED16.K 67.87,8.23 69.49,6.6 69.49,6.5 72.03,3.96 75.69,3.96 83.01,11.28 83.01,13.51 v83.11,13.61 | v52.22,16.46 52.93,16.46 54.25,15.14 61.57,15.14 61.62,15.19
  Bottom 0.203: v58.83,22.25 v58.83,25.2 | v52.22,16.46 43.48,16.46 U$4.8 | 83.11,17.37 82.3,17.37 81.99,17.68 80.87,17.68 80.16,16.97 80.16,15.14 77.62,15.14 76.4,16.36 U$6.4 | 83.11,17.37 141.63,17.37 141.63,34.95 140.92,35.66 140.61,35.66 140.61,37.8 K8.16 | 83.11,17.37 v83.11,13.61
I2C_SCL  (via drill 0.41)
  Top 0.203: R2.2 28.85,27.53 29.46,28.14 29.57,28.14 30.58,29.16 30.58,30.79 32.41,32.61 32.41,34.85 SERIAL.4 | v73.76,19.71 74.78,20.73 76.2,20.73 IC2.12
  Bottom 0.203: v73.76,19.71 73.56,19.91 71.93,19.91 71.63,19.61 65.13,19.61 63.2,21.54 41.55,21.54 41.25,21.84 38.51,21.84 38,22.35 38,33.53 33.83,33.53 32.51,34.85 SERIAL.4
I2C_SDA  (via drill 0.41)
  Top 0.203: R1.2 28.85,29.06 28.85,29.67 31.19,32 31.19,36.17 32.41,37.39 SERIAL.3 | v75.08,15.44 75.08,19.81 75.39,20.12 76.2,20.12 IC2.13 | v66.85,16.97 62.99,20.83 v62.79,20.83
  Bottom 0.203: v75.08,15.44 74.78,15.14 68.68,15.14 v66.85,16.97 | v62.79,20.83 62.48,21.13 38.71,21.13 38.41,21.44 35.87,21.44 27.53,29.77 27.53,33.53 30.38,33.53 31.19,34.34 31.19,37.39 32.41,37.39 SERIAL.3
N$1
  Top 0.305: K1.S1 86.46,30.18 86.46,25.81 90.22,22.05 90.22,15.65 96.83,9.04 102.21,9.04 103.33,10.16 X1.23
N$2
  Top 0.203: JP2.8 14.02,25.5 14.02,27.64 14.43,28.04 14.43,31.09 U$8.1
N$3
  Bottom 0.203: JP2.7 13.01,24.59 13.01,28.55 13.11,28.55 U$8.2
N$4
  Top 0.203: JP2.6 11.99,27.94 11.89,28.04 11.89,31.09 U$8.3
N$5  (via drill 0.41)
  Top 0.203: v69.7,34.54 76.2,28.04 IC2.1 | v48.77,34.54 47.55,34.54 47.14,34.14 IC1.1
  Bottom 0.203: v48.77,34.54 v69.7,34.54
N$6  (via drill 0.3)
  Top 0.305: v100.69,26.62 100.69,12.29 101.5,11.48 104.85,11.48 106.07,10.26 X1.22
  Bottom 0.305: v100.69,26.62 97.03,26.62 93.47,30.18 K2.S1
N$7
  Bottom 0.203: JP2.5 10.97,24.59 10.97,28.55 10.67,28.55 U$8.4
N$8
  Top 0.203: JP2.4 9.96,25.5 9.96,27.43 9.35,28.04 9.35,31.09 U$8.5
N$9
  Bottom 0.203: JP2.3 8.94,24.59 8.94,28.55 8.13,28.55 U$8.6
N$10
  Top 0.305: K3.S1 100.48,30.18 102.21,30.18 104.44,27.94 104.44,14.73 106.27,12.9 106.27,12.29 108.31,10.26 108.81,10.26 X1.21
N$11
  Top 0.203: JP2.2 7.92,25.5 7.92,26.92 6.81,28.04 6.81,31.09 U$8.7
N$12
  Top 0.203: JP2.1 6.91,24.59 6.91,27.23 5.59,28.55 U$8.8
N$14
  Top 0.305: K4.S1 107.49,30.18 109.83,30.18 112.06,27.94 112.06,13.51 111.66,13.11 111.66,10.26 X1.20
N$18
  Top 0.305: K5.S1 114.4,30.18 114.4,28.96 113.39,27.94 113.39,14.12 114.3,13.21 114.3,10.26 X1.19
N$22
  Top 0.305: K6.S1 121.51,30.18 121.51,29.97 123.55,27.94 123.55,16.05 121.51,14.02 120.8,14.02 119.69,12.9 119.69,12.19 117.75,10.26 117.14,10.26 X1.18
N$26
  Top 0.305: K7.S1 128.42,30.18 128.12,30.18 126.19,28.25 125.27,28.25 124.16,27.13 124.16,14.53 122.53,12.9 122.53,12.29 120.5,10.26 119.99,10.26 X1.17
N$27  (via drill 0.41)
  Top 0.203: v9.14,12.09 18.29,21.23 21.95,21.23 22.55,20.62 28.04,20.62 RN7.8
  Bottom 0.203: v9.14,12.09 9.14,1.32 10.97,1.32 LED9.A
N$30  (via drill 0.3)
  Top 0.305: v135.33,20.22 135.33,15.65 128.73,9.04 123.85,9.04 122.73,10.16 X1.16
  Bottom 0.305: v135.33,20.22 135.43,20.22 135.43,30.18 K8.S1
N$31  (via drill 0.41)
  Top 0.203: v9.55,13.51 17.68,21.64 28.25,21.64 28.85,21.03 28.85,20.62 RN7.7
  Bottom 0.203: v9.55,13.51 9.55,12.7 9.86,12.39 9.86,6.2 10.97,6.2 LED10.A
N$34  (via drill 0.41)
  Top 0.203: v69.49,33.53 69.49,33.33 75.49,27.33 76.2,27.33 IC2.2 | v48.67,33.53 48.36,33.53 47.75,32.92 47.14,32.92 IC1.2
  Bottom 0.203: v69.49,33.53 68.89,34.14 49.38,34.14 48.77,33.53 v48.67,33.53
N$35  (via drill 0.41)
  Top 0.203: v68.58,33.43 75.29,26.72 76.2,26.72 IC2.3 | v49.68,33.43 47.85,31.6 47.14,31.6 IC1.3
  Bottom 0.203: v49.68,33.43 v68.58,33.43
N$36  (via drill 0.41)
  Top 0.203: v77.62,26.42 77.32,26.11 76.3,26.11 IC2.4 | v66.85,32.72 v71.42,28.14 | v51.21,32.72 50.09,32.72 47.75,30.38 47.14,30.38 IC1.4
  Bottom 0.203: v77.62,26.42 75.89,28.14 v71.42,28.14 | v51.21,32.72 v66.85,32.72
N$37  (via drill 0.41)
  Top 0.203: v73.66,32 78.33,27.33 78.33,26.11 77.62,25.4 76.3,25.4 IC2.5 | v50.6,32 47.65,29.06 47.14,29.06 IC1.5
  Bottom 0.203: v50.6,32 v73.66,32
N$38  (via drill 0.41)
  Top 0.203: v69.7,31.29 74.47,26.52 74.47,25.7 75.39,24.79 76.2,24.79 IC2.6 | v51.82,31.29 51.21,31.29 47.75,27.84 47.14,27.84 IC1.6
  Bottom 0.203: v51.82,31.29 v69.7,31.29
N$39  (via drill 0.41)
  Top 0.203: v73.76,26.21 73.76,25.81 75.49,24.08 76.2,24.08 IC2.7 | v50.49,25.91 47.65,25.91 47.14,26.42 IC1.7
  Bottom 0.203: v73.76,26.21 73.46,25.91 v50.49,25.91
N$40  (via drill 0.41)
  Top 0.203: v72.34,26.62 75.49,23.47 76.2,23.47 IC2.8 | v48.77,25.2 47.14,25.2 IC1.8
  Bottom 0.203: v72.34,26.62 50.19,26.62 v48.77,25.2
N$49  (via drill 0.3)
  Top 0.152: v94.28,15.04 94.28,17.17 OK1.2
  Bottom 0.152: v94.28,15.04 95.4,13.92 103.53,13.92 104.65,12.8 X1.10
N$50  (via drill 0.41)
  Top 0.203: v86.16,19.71 86.16,20.52 RN3.1 | v92.15,19 92.15,17.68 91.75,17.27 OK1.1
  Bottom 0.203: v86.16,19.71 91.44,19.71 v92.15,19
N$51  (via drill 0.41)
  Top 0.203: v87.07,24.08 86.46,23.47 83.52,23.47 IC2.21 | v89.92,24.99 91.64,26.72 OK1.8
  Bottom 0.203: v87.07,24.08 87.99,24.99 v89.92,24.99
N$52  (via drill 0.41)
  Top 0.203: v86.97,16.26 86.97,20.52 RN3.2 | v95.61,15.75 95.61,16.05 96.72,17.17 OK1.3
  Bottom 0.203: v86.97,16.26 87.48,15.75 v95.61,15.75
N$53  (via drill 0.41)
  Top 0.203: v87.78,19 87.78,20.52 RN3.3 | v101.8,18.09 102.31,18.09 103.12,17.27 OK2.1
  Bottom 0.203: v87.78,19 88.7,18.09 v101.8,18.09
N$54  (via drill 0.41)
  Top 0.203: v89.41,20.52 88.49,20.52 RN3.4 | v105.36,20.12 108.2,17.27 OK2.3
  Bottom 0.203: v89.41,20.52 89.81,20.12 v105.36,20.12
N$55
  Top 0.152: OK3.2 117.14,17.17 117.14,14.12 115.82,12.8 X1.6
N$56
  Top 0.203: RN4.1 136.14,20.62 136.14,20.93 134.93,22.15 134.93,27.94 133.71,29.16 131.06,29.16 128.93,31.29 119.18,31.29 115.82,27.94 115.82,18.39 114.71,17.27 OK3.1
N$57
  Top 0.203: RN4.2 136.85,20.52 136.85,16.36 129.03,8.53 117.25,8.53 115.93,9.86 115.93,11.28 117.35,12.7 117.35,13.61 119.69,15.95 119.69,17.17 OK3.3
N$58  (via drill 0.41)
  Top 0.203: v137.67,18.8 137.67,20.52 RN4.3 | v127.51,18.69 127.51,18.49 126.29,17.27 OK4.1
  Bottom 0.203: v137.67,18.8 137.57,18.69 v127.51,18.69
N$59  (via drill 0.41)
  Top 0.203: v138.48,19.71 138.48,20.52 RN4.4 | v133.6,19.51 131.37,17.27 OK4.3
  Bottom 0.203: v138.48,19.71 138.28,19.51 v133.6,19.51
N$60  (via drill 0.3)
  Top 0.152: v99.36,15.65 99.36,17.17 OK1.4
  Bottom 0.152: v99.36,15.65 100.69,14.33 105.87,14.33 107.39,12.8 X1.9
N$61
  Top 0.152: OK2.2 105.77,17.17 110.13,12.8 X1.8
N$62  (via drill 0.3)
  Top 0.152: v110.85,14.94 110.85,17.17 OK2.4
  Bottom 0.152: v110.85,14.94 112.98,12.8 X1.7
N$63  (via drill 0.41)
  Top 0.203: v83.52,30.89 83.52,28.04 IC2.28 | v130.05,25.4 131.37,26.72 OK4.6
  Bottom 0.203: v83.52,30.89 86.06,33.43 124.05,33.43 126.19,31.29 128.93,31.29 130.05,30.18 v130.05,25.4
N$64
  Top 0.152: OK3.4 122.22,17.17 122.22,16.46 118.57,12.8 X1.5
N$65  (via drill 0.3)
  Top 0.152: v126.9,15.34 128.73,17.17 OK4.2
  Bottom 0.152: v126.9,15.34 125.48,13.92 122.43,13.92 121.31,12.8 X1.4
N$66  (via drill 0.3)
  Top 0.152: v130.25,11.58 133.81,15.14 133.81,17.17 OK4.4
  Bottom 0.152: v130.25,11.58 125.17,11.58 124.05,12.7 X1.3
N$68  (via drill 0.41)
  Top 0.203: v85.65,26.82 85.95,26.52 85.95,24.49 85.55,24.08 IC2.22 | v94.18,28.35 95.2,28.35 96.72,26.82 OK1.6
  Bottom 0.203: v85.65,26.82 87.17,28.35 v94.18,28.35
N$69  (via drill 0.41)
  Top 0.203: v81.48,26.21 81.48,25.09 81.89,24.69 83.41,24.69 IC2.23 | v102.51,25.2 102.51,26.11 103.12,26.72 OK2.8
  Bottom 0.203: v81.48,26.21 81.58,26.11 99.77,26.11 100.69,25.2 v102.51,25.2
N$70  (via drill 0.41)
  Top 0.203: v82.19,25.4 83.41,25.4 IC2.24 | v105.66,24.18 108.2,26.72 OK2.6
  Bottom 0.203: v82.19,25.4 82.5,25.7 97.74,25.7 99.26,24.18 v105.66,24.18
N$71
  Top 0.203: IC2.25 83.41,26.11 82.6,26.11 82.4,26.31 82.4,29.77 82.8,30.18 82.8,31.19 83.21,31.6 85.75,31.6 86.06,31.29 87.68,31.29 89.92,29.06 95.91,29.06 98.15,31.29 114.91,31.29 115.62,30.58 115.62,28.35 114.71,27.43 114.71,26.82 OK3.8
N$72  (via drill 0.41)
  Top 0.203: v85.24,24.79 85.24,25.7 84.33,26.62 83.52,26.62 IC2.26 | v118.16,25.2 119.69,26.72 OK3.6
  Bottom 0.203: v85.24,24.79 86.67,23.37 116.33,23.37 v118.16,25.2
N$73  (via drill 0.41)
  Top 0.203: v85.14,30.48 85.14,28.14 84.33,27.33 IC2.27 | v127.41,28.25 127.41,27.94 126.29,26.82 OK4.8
  Bottom 0.203: v85.14,30.48 85.95,31.29 123.95,31.29 127,28.25 v127.41,28.25
N$76  (via drill 0.41)
  Top 0.203: v27.53,16.66 27.53,19.61 27.74,19.81 29.26,19.81 29.67,20.22 29.67,20.52 RN7.6 | v19.91,12.39 19.91,9.86 28.45,1.32 29.67,1.32 LED11.A
  Bottom 0.203: v27.53,16.66 24.49,13.61 24.49,12.39 v19.91,12.39
N$77  (via drill 0.41)
  Top 0.203: v30.38,21.64 30.48,21.54 30.48,20.62 RN7.5 | v39.73,19.1 v38.3,20.52 | v45.21,19 45.21,12.9 v44.4,12.09
  Bottom 0.203: v30.38,21.64 31.5,20.52 v38.3,20.52 | v39.73,19.1 39.83,19 v45.21,19 | v44.4,12.09 37.8,5.49 30.07,5.49 29.87,5.69 LED12.A
N$78  (via drill 0.41)
  Top 0.203: v66.14,21.64 66.14,20.62 RN8.8 | v78.33,18.8 80.16,16.97 80.16,15.85 81.18,14.83 v81.38,14.83 | v73.86,5.38 v81.48,13.01 | v69.6,5.38 69.6,4.06 67.67,2.13 49.07,2.13 48.36,1.42 LED13.A
  Bottom 0.203: v66.14,21.64 66.14,20.93 68.68,20.93 69.09,21.34 71.93,21.34 72.85,20.42 76.71,20.42 v78.33,18.8 | v81.38,14.83 81.38,14.43 81.48,14.33 v81.48,13.01 | v69.6,5.38 v73.86,5.38
N$79  (via drill 0.41)
  Top 0.203: v67.06,21.64 67.06,20.62 RN8.7 | v83.01,18.59 83.01,18.19 83.11,18.09 83.11,14.63 82.4,13.92 82.4,11.68 v75.39,4.67
  Bottom 0.203: v67.06,21.64 67.16,21.74 72.14,21.74 73.05,20.83 78.33,20.83 80.57,18.59 v83.01,18.59 | v75.39,4.67 49.07,4.67 48.36,5.38 LED14.A
N$80  (via drill 0.41)
  Top 0.203: v67.87,23.98 67.87,20.62 RN8.6 | v83.92,14.33 v83.92,18.19 | v76.81,7.11 v81.69,11.99
  Bottom 0.203: v67.87,23.98 69.39,25.5 79.15,25.5 79.86,26.21 80.47,26.21 81.48,25.2 81.48,22.66 82.4,22.66 83.92,21.13 v83.92,18.19 | v83.92,14.33 83.92,12.8 82.5,12.8 v81.69,11.99 | v76.81,7.11 76.81,1.12 67.87,1.12 LED15.A
N$81  (via drill 0.41)
  Top 0.203: v69.39,20.62 68.58,20.62 RN8.5 | v71.32,20.32 71.32,19.81 v64.52,13.01 | v63.09,10.36 v63.09,11.99
  Bottom 0.203: v69.39,20.62 69.7,20.32 v71.32,20.32 | v64.52,13.01 63.5,11.99 v63.09,11.99 | v63.09,10.36 63.91,9.55 64.52,9.55 67.77,6.3 67.77,5.79 LED16.A
N$82  (via drill 0.41)
  Top 0.203: v73.76,18.8 73.76,16.46 U$6.2 | v55.17,18.39 55.17,16.76 54.86,16.46 U$5.2
  Bottom 0.203: JP1.2 2.54,17.98 15.24,17.98 16.76,16.46 U$3.2 16.87,16.46 20.22,19.81 51.41,19.81 51.61,20.02 56.69,20.02 56.74,19.96 | U$4.2 35.87,16.36 37.08,15.14 51.92,15.14 53.14,16.36 54.76,16.36 U$5.2 | v73.76,18.8 73.66,18.9 58.52,18.9 57.4,20.02 56.79,20.02 56.74,19.96 | v55.17,18.39 56.74,19.96

### Text on the board
_tsilk: 1 | SKAARHOJ 2012 | Tally Board | v13-12-12 | 5V | GND | GND | 12V | O | 1-2-3 | 2-3-4 | 3-4-1 | 4-1-2
_bsilk: PRV LED | PRG LED